# Altium schematic sheet Main_scheme.SchDoc
size 420 x 297 mm; Author: ALTIUM GOSTBOM2.0 KEV; SheetNumber: 1; SheetTotal: 1
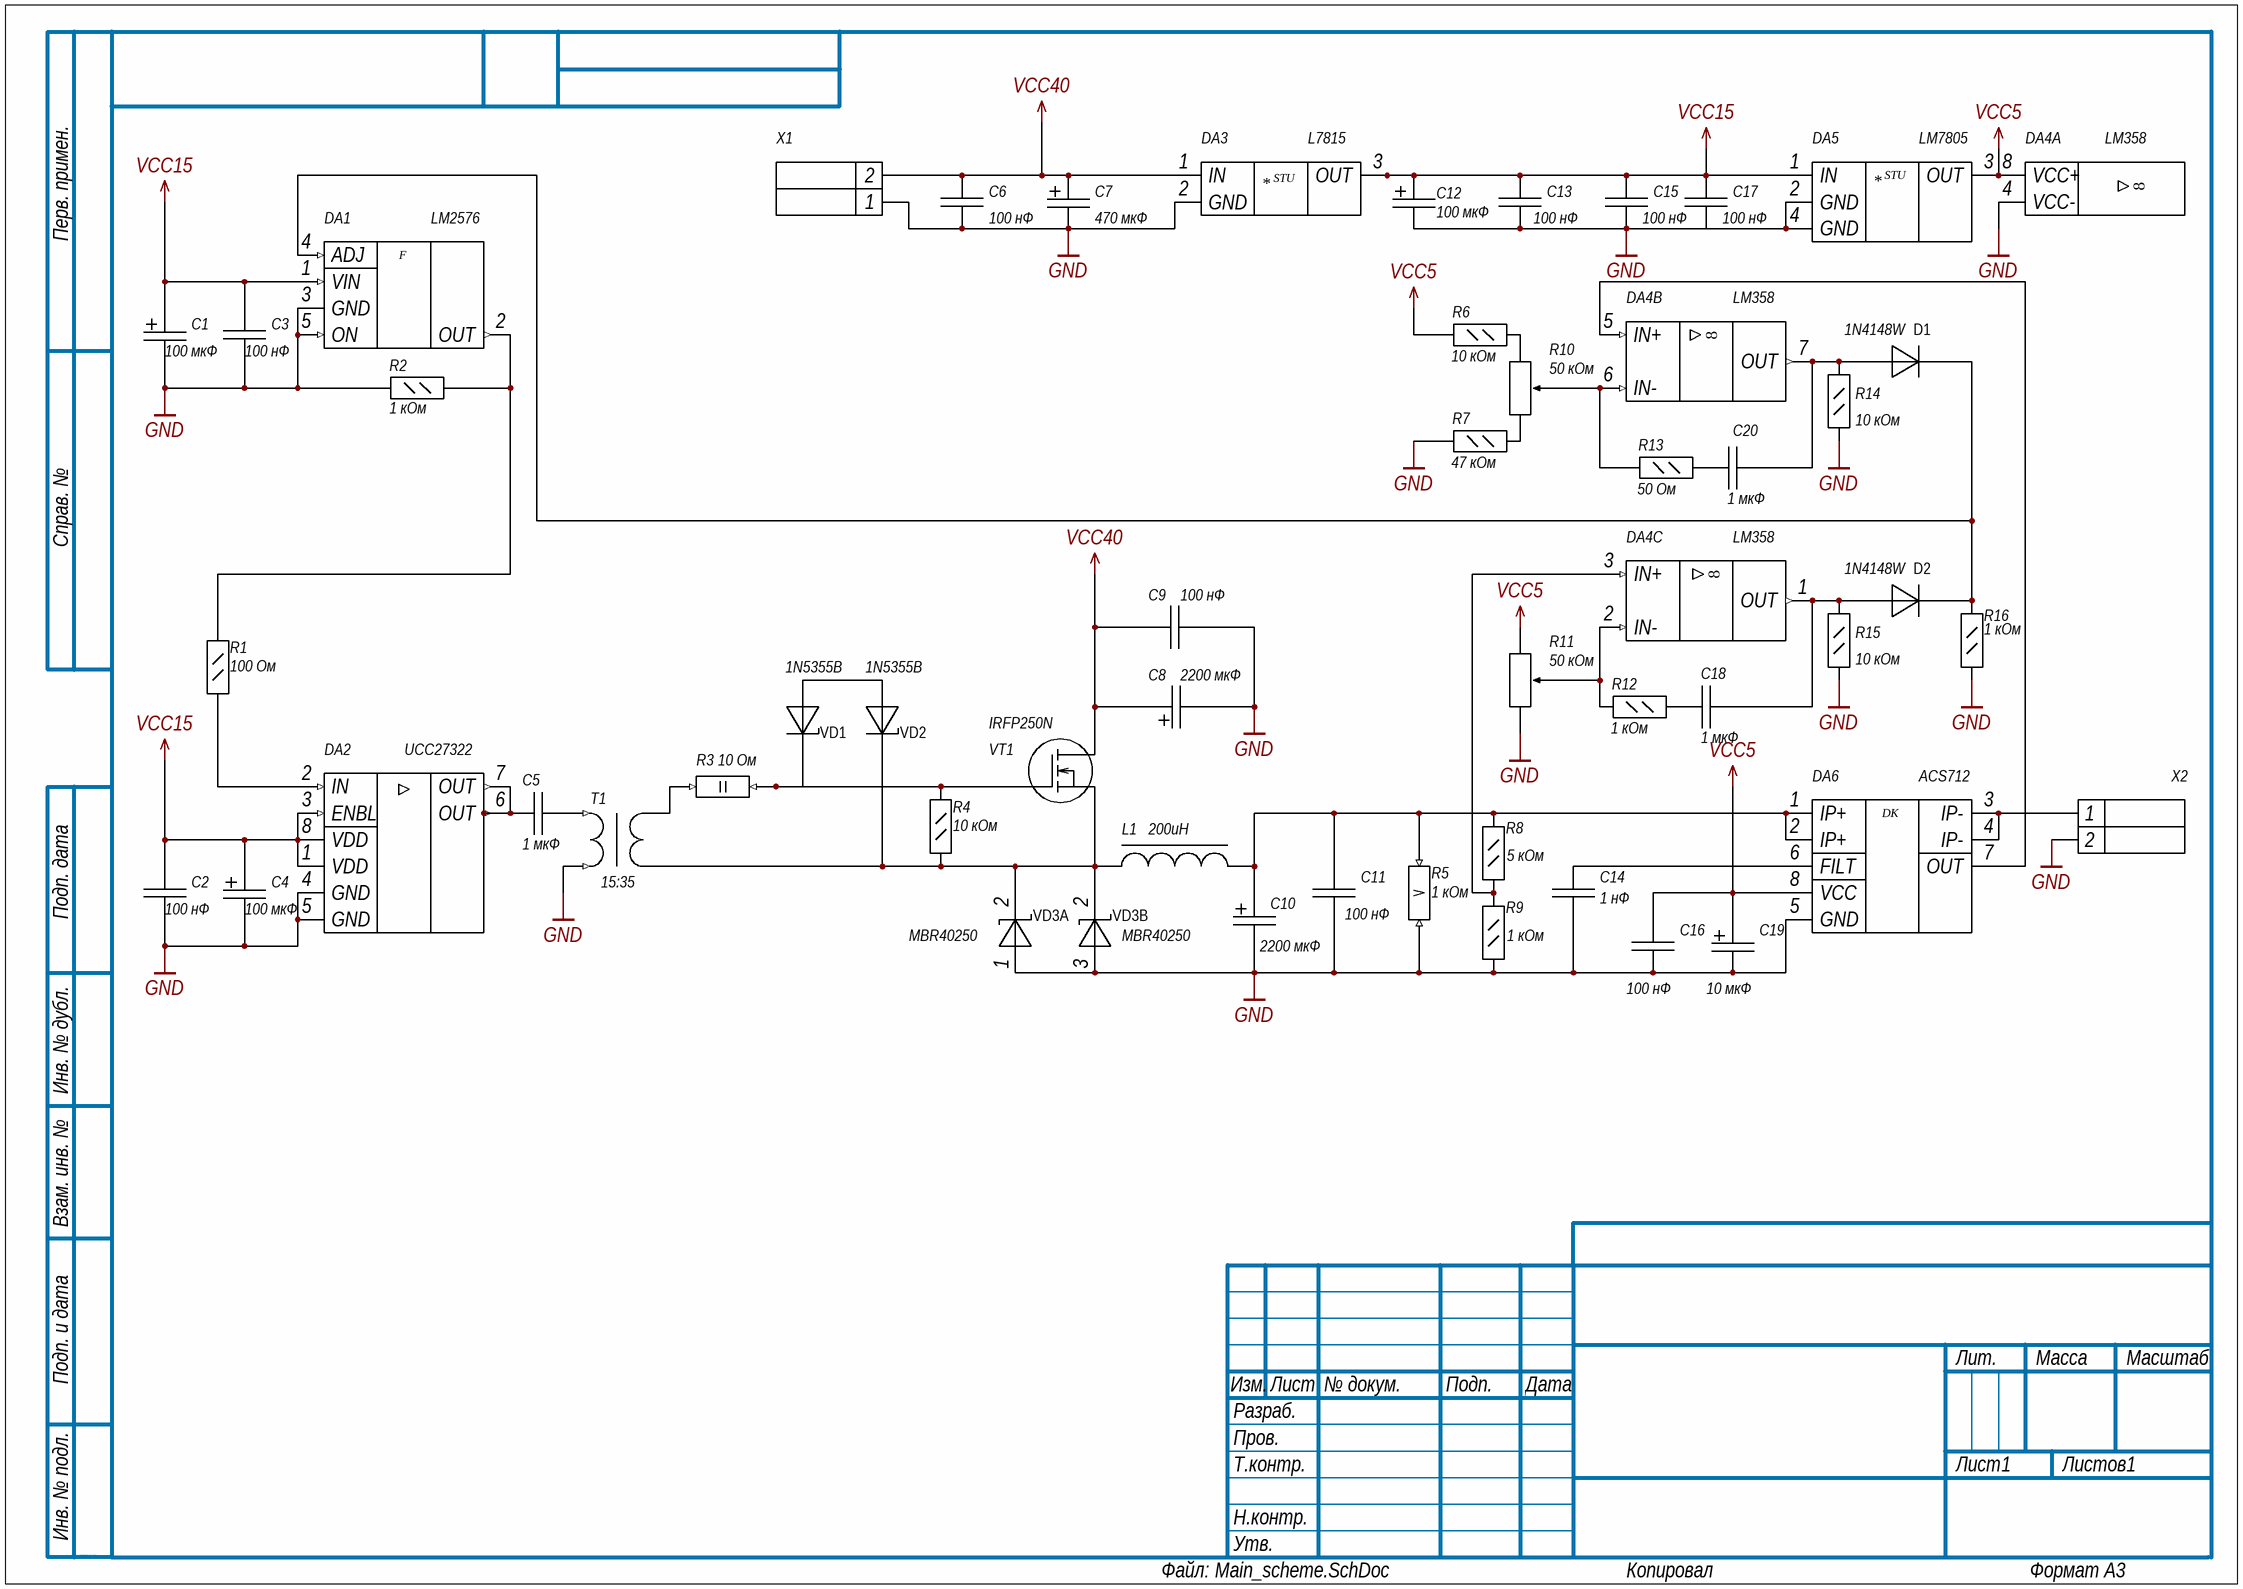
[diagram p0: Main_scheme.SchDoc]

## Parts
C1  100 мкФ  [CAP TH ALUM ELEC D8.00mm S3.50mm H12.50mm]
C2  100 нФ  [CAPC2012L-С0805]
C3  100 нФ  [CAPC2012L-С0805]
C4  100 мкФ  [CAP TH ALUM ELEC D8.00mm S3.50mm H12.50mm]
C5  1 мкФ  [CAP FILM 1210]
C6  100 нФ  [CAPC2012L-С0805]
C7  470 мкФ  [CAP TH ALUM ELEC D10.00mm S5.00mm H10.50mm]
C8  2200 мкФ  [CAP TH ALUM ELEC D18.00mm S7.50mm H42.00mm]
C9  100 нФ  [CAPC2012L-С0805]
C10  2200 мкФ  [CAP TH ALUM ELEC D18.00mm S7.50mm H42.00mm]
C11  100 нФ  [CAPC2012L-С0805]
C12  100 мкФ  [CAP TH ALUM ELEC D8.00mm S3.50mm H12.50mm]
C13  100 нФ  [CAPC2012L-С0805]
C14  1 нФ  [CAPC2012L-С0805]
C15  100 нФ  [CAPC2012L-С0805]
C16  100 нФ  [CAPC2012L-С0805]
C17  100 нФ  [CAPC2012L-С0805]
C18  1 мкФ  [CAPC2012L-С0805]
C19  10 мкФ  [CAP TH ALUM ELEC D5.00mm S2.00mm H11.00mm]
C20  1 мкФ  [CAPC2012L-С0805]
D1  1N4148W  [1N4148WVGS08]
D2  1N4148W  [1N4148WVGS08]
DA1  LM2576  [LM2576]
DA2  UCC27322  [SOIC127P599X175-8N]
DA3  L7815  [TO255P460X1020X2030-3P]
DA4  LM358  [SOIC127P600X175-8N]  (parts A,B,C of 3)
DA5  LM7805  [SOT230P700X180-4N]
DA6  ACS712  [SOIC127P600X175-8N]
L1  200uH  [IND_HCTI-220-5.8]
R1  100 Ом  [RESC2012N]
R2  1 кОм  [RESC2012N]
R3  10 Ом  [FP-MCS3264-IPC_A]
R4  10 кОм  [RESC2012N]
R5  1 кОм  [RESAD2860W80L2200D950]
R6  10 кОм  [RESC2012N]
R7  47 кОм  [RESC2012N]
R8  5 кОм  [RESC2012N]
R9  1 кОм  [RESC2012N]
R10  50 кОм  [PDB181K220K104B]
R11  50 кОм  [PDB181K220K104B]
R12  1 кОм  [RESC2012N]
R13  50 Ом  [RESC2012N]
R14  10 кОм  [RESC2012N]
R15  10 кОм  [RESC2012N]
R16  1 кОм  [RESC2012N]
T1  15:35  [WE-GDT_EP5]
VD1  1N5355B  [DIOAD2260W109L864D349]
VD2  1N5355B  [DIOAD2260W109L864D349]
VD3  MBR40250  [TO254P483X1010X2035-3P]  (parts A,B of 2)
VT1  IRFP250N  [TO545P530X1560X2460-3P]
X1  (no value)  [KLEMNIK2]
X2  (no value)  [KLEMNIK2]

## Nets
GND: C1.2 C2.1 C3.1 C4.2 C6.1 C7.2 C8.2 C9.1 C10.2 C11.1 C12.2 C13.1 C14.1 C15.1 C16.1 C17.1 C19.2 DA1.3(GND) DA1.5(ON) DA2.4(GND) DA2.5(GND) DA3.2(GND) DA4.4(VCC-) DA5.2(GND) DA5.4(GND) DA6.5(GND) R2.1 R5.1 R7.1 R9.2 R11.1(CCW) R14.2 R15.2 R16.2 T1.6 VD3.1(A_1) VD3.3(A_2) X1.1 X2.2
VCC5: C16.2 C19.1 DA4.8(VCC+) DA5.3(OUT) DA6.8(VCC) R6.1 R11.3(CW)
VCC15: C1.1 C2.2 C3.2 C4.1 C12.1 C13.2 C15.2 C17.2 DA1.1(VIN) DA2.1(VDD) DA2.3(ENBL) DA2.8(VDD) DA3.3(OUT) DA5.1(IN)
VCC40: C6.2 C7.1 C8.1 C9.2 DA3.1(IN) VT1.2(D) X1.2
NetC5_1: C5.1 T1.4
NetC5_2: C5.2 DA2.6(OUT) DA2.7(OUT)
NetC10_1: C10.1 C11.2 DA6.1(IP+) DA6.2(IP+) L1.2 R5.2 R8.1
NetC14_2: C14.2 DA6.6(FILT)
NetC18_1: C18.1 D2.2(A) DA4.1(OUT) R15.1
NetC18_2: C18.2 R12.2
NetC20_1: C20.1 D1.2(A) DA4.7(OUT) R14.1
NetC20_2: C20.2 R13.2
NetD1_1: D1.1(K) D2.1(K) DA1.4(ADJ) R16.1
NetDA1_2: DA1.2(OUT) R1.2 R2.2
NetDA2_2: DA2.2(IN) R1.1
NetDA4_2: DA4.2(IN-) R11.2(WIPER) R12.1
NetDA4_3: DA4.3(IN+) R8.2 R9.1
NetDA4_5: DA4.5(IN+) DA6.7(OUT)
NetDA4_6: DA4.6(IN-) R10.2(WIPER) R13.1
NetDA6_3: DA6.3(IP-) DA6.4(IP-) X2.1
NetL1_1: L1.1 R4.1 T1.3 VD2.2(A) VD3.2(K) VT1.3(S)
NetR3_1: R3.1 T1.1
NetR3_2: R3.2 R4.2 VD1.2(A) VT1.1(G)
NetR6_2: R6.2 R10.3(CW)
NetR7_2: R7.2 R10.1(CCW)
NetVD1_1: VD1.1(K) VD2.1(K)

## Notes on the sheet
- Перв. примен.
- Справ. №
- Подп. дата
- Инв. № дубл.
- Взам. инв. №
- Подп. и дата
- Изм.
- Разраб.
- Лист
- № докум.
- Подп.
- Дата
- Лит.
- Масса
- Масштаб
- Пров.
- Т.контр.
- Листов
- Инв. № подл.
- Н.контр.
- Утв.
- ALTIUM GOSTBOM2.0 KEV
- Файл:
- Копировал
- Формат А3
- (in symbol ACS712ELCTR-05B-T) DK
- (in symbol L7815CP) STU
- (in symbol LM2576-ADJ) F
- (in symbol LM7805MPX_NOPB) STU

## Library data of the parts
C1 C4 C12 = Polarised Capacitor_2: CAP ALUM 100UF 20% 25V RADIAL; Part Number: UKL1E101KPDANATD; manufacturer: Nichicon; Capacitance: 100µF; Lifetime @ Temp.: 1000 Hrs @ 105°C; Polarization: Polar; Ripple Current @ High Frequency: 420mA @ 10kHz; Ripple Current @ Low Frequency: 280mA @ 120Hz; Tolerance: ±10%; value: 100µF; Applications: General Purpose; componentlink1description: Datasheet; componentlink1url: http://nichicon-us.com/english/products/pdfs/e-ukl.pdf; componentlink2description: DigiKey Link; componentlink2url: http://digikey.com/product-detail/en/nichicon/UKL1E101KPDANATD/493-15360-1-ND/6555998; Device Package: Radial, Can; Height - Seated (Max): 0.492" (12.50mm); lastupdated: 07.09.2020 5:24:52; Lead Spacing: 0.138" (3.50mm); Lifecycle Status: Active; Minimum Order: 1; Mounting Type: Through Hole; Operating Temperature: -40°C ~ 105°C; Package / Case: Radial, Can; packaging: TapeAndBox; partid: 7205; Part Status: Active; price: 0.16; series: UKL; Size / Dimension: 0.315" Dia (8.00mm); Supplier 1: DigiKey; Supplier Part Number 1: 493-15360-1-ND; Voltage - Rated: 25V
C2 C3 C6 C9 C11 C13-C18 C20 = C0805: планарный конденсатор; Value: 0,1 мкФ
C5 = Capacitor_1: CAP FILM 1UF 20% 35VDC 1210; Part Number: 35MU105MB13225; Manufacturer: Rubycon; Dielectric Material: Acrylic, Metallized; Value: 1 µF; Voltage Rating - DC: 35V; Capacitance: 1 мкФ; Applications: DC Link, DC Filtering; ComponentLink1Description: Datasheet; ComponentLink1URL: http://www.rubycon.co.jp/en/catalog/e_pdfs/pmlcap/e_MU.pdf; ComponentLink2Description: DigiKey Link; ComponentLink2URL: https://www.digikey.com/en/products/detail/rubycon/35MU105MB13225/4969535; Device Package: 1210 (3225 Metric); Height - Seated (Max): 0.063" (1.60mm); LastUpdated: 01.11.2023 20:43:30; Lifecycle Status: Active; Minimum Order: 1; Mounting Type: Surface Mount; Operating Temperature: -55°C ~ 125°C; Package / Case: 1210 (3225 Metric); Packaging: TapeAndReel; Part Status: Active; Price: 2.41; Series: PMLCAP®, MU; Size / Dimension: 0.126" L x 0.098" W (3.20mm x 2.50mm); Supplier 1: DigiKey; Supplier Part Number 1: 1189-2529-1-ND; Termination: Solder Pads; Tolerance: ±20%
C7 = Polarised Capacitor_3: CAP ALUM 470UF 20% 25V RADIAL; Part Number: 25WA470MEFCT810X9; manufacturer: Rubycon; Capacitance: 470µF; Lifetime @ Temp.: 2000 Hrs @ 85°C; Polarization: Polar; Ripple Current @ Low Frequency: 460mA @ 120Hz; value: 470µF; Applications: General Purpose; componentlink1description: Datasheet; componentlink1url: http://www.rubycon.co.jp/en/catalog/e_pdfs/aluminum/e_wa.pdf; componentlink2description: DigiKey Link; componentlink2url: http://digikey.com/product-detail/en/rubycon/25WA470MEFCT810X9/1189-3717-1-ND/6599186; Device Package: Radial, Can; Height - Seated (Max): 0.413" (10.50mm); lastupdated: 02.09.2020 1:26:22; Lead Spacing: 0.197" (5.00mm); Lifecycle Status: Active; Minimum Order: 1; Mounting Type: Through Hole; Operating Temperature: -40°C ~ 85°C; Package / Case: Radial, Can; packaging: TapeAndBox; partid: 9499; Part Status: Active; price: 0.17; series: WA; Size / Dimension: 0.394" Dia (10.00mm); Supplier 1: DigiKey; Supplier Part Number 1: 1189-3717-1-ND; Tolerance: ±20%; Voltage - Rated: 25V
C8 C10 = Polarised Capacitor: CAP ALUM 2200UF 20% 50V RADIAL; Part Number: 50RX302200M18X40; manufacturer: Rubycon; Capacitance: 2200µF; Impedance: 29 mOhms; Lifetime @ Temp.: 4000 Hrs @ 130°C; Polarization: Polar; Ripple Current @ High Frequency: 2.8A @ 100kHz; Ripple Current @ Low Frequency: 2.24A @ 120Hz; value: 2200µF; Applications: Automotive; componentlink1description: Datasheet; componentlink1url: http://www.rubycon.co.jp/en/catalog/e_pdfs/aluminum/e_rx30.pdf; componentlink2description: DigiKey Link; componentlink2url: http://digikey.com/product-detail/en/rubycon/50RX302200M18X40/1189-1410-ND/3134366; Device Package: Radial, Can; Height - Seated (Max): 1.654" (42.00mm); lastupdated: 02.09.2020 1:33:35; Lead Spacing: 0.295" (7.50mm); Lifecycle Status: Active; Minimum Order: 1; Mounting Type: Through Hole; Operating Temperature: -40°C ~ 130°C; Package / Case: Radial, Can; packaging: Bulk; partid: 9389; Part Status: Active; price: 3.85; Ratings: AEC-Q200; series: RX30; Size / Dimension: 0.709" Dia (18.00mm); Supplier 1: DigiKey; Supplier Part Number 1: 1189-1410-ND; Tolerance: ±20%; Voltage - Rated: 50V
C19 = Polarised Capacitor_1: CAP ALUM 10UF 20% 16V RADIAL; Part Number: UPW1C100MDD; manufacturer: Nichicon; Capacitance: 10µF; Impedance: 600 mOhms; Lifetime @ Temp.: 2000 Hrs @ 105°C; Polarization: Polar; Ripple Current @ High Frequency: 180mA @ 100kHz; Ripple Current @ Low Frequency: 54mA @ 120Hz; value: 10µF; Applications: General Purpose; componentlink1description: Datasheet; componentlink1url: http://nichicon-us.com/english/products/pdfs/e-upw.pdf; componentlink2description: DigiKey Link; componentlink2url: http://digikey.com/product-detail/en/nichicon/UPW1C100MDD/493-1767-ND/589508; Device Package: Radial, Can; Height - Seated (Max): 0.433" (11.00mm); lastupdated: 04.09.2020 23:28:56; Lead Spacing: 0.079" (2.00mm); Lifecycle Status: Active; Minimum Order: 1; Mounting Type: Through Hole; Operating Temperature: -55°C ~ 105°C; Package / Case: Radial, Can; packaging: Bulk; partid: 21402; Part Status: Active; price: 0.26; series: UPW; Size / Dimension: 0.197" Dia (5.00mm); Supplier 1: DigiKey; Supplier Part Number 1: 493-1767-ND; Tolerance: ±20%; Voltage - Rated: 16V
D1 D2 = 1N4148W-V-GS08: Diode; Manufacturer_Name: Vishay; Datasheet Link: https://us.rs-online.com/m/d/a2789c8794cb0c42ced29f2dd8571f3c.pdf; Height: 1.35mm; Manufacturer_Part_Number: 1N4148W-V-GS08; Mouser Part Number: 625-1N4148W-V; Mouser Price/Stock: https://www.mouser.co.uk/ProductDetail/Vishay-Semiconductors/1N4148W-V-GS08?qs=TNTIDjy6APrS%2Fdgq1RSs3A%3D%3D; Arrow Part Number: 1N4148W-V-GS08; Arrow Price/Stock: https://www.arrow.com/en/products/1n4148w-v-gs08/vishay
DA1 = LM2576-ADJ: Buck-boost converter
DA2 = UCC27322: Single 9-A High-Speed Low-Side Mosfet Driver With Enable
DA3 = L7815CP: 15 V Linear stab; Manufacturer_Name: STMicroelectronics; Datasheet Link: http://www.st.com/web/en/resource/technical/document/datasheet/CD00000444.pdf; Height: 4.6mm; Manufacturer_Part_Number: L7815CP; Mouser Part Number: 511-L7815CP; Mouser Price/Stock: https://www.mouser.co.uk/ProductDetail/STMicroelectronics/L7815CP?qs=%252BX2uje6VeKVI9cfwuCNq4A%3D%3D; Arrow Part Number: L7815CP; Arrow Price/Stock: https://www.arrow.com/en/products/l7815cp/stmicroelectronics?region=europe
DA4 = LM358: OP AMP
DA5 = LM7805MPX_NOPB: 5 V Linear stab; Manufacturer_Name: Texas Instruments; Manufacturer_Part_Number: LM7805MPX/NOPB; Datasheet Link: https://www.arrow.com/en/products/lm7805mpxnopb/texas-instruments; Height: 1.8mm; Mouser Part Number: 595-LM7805MPX/NOPB; Mouser Price/Stock: https://www.mouser.co.uk/ProductDetail/Texas-Instruments/LM7805MPX-NOPB?qs=gO6GG99qvRCSwIVAoVKHPw%3D%3D; Arrow Part Number: LM7805MPX/NOPB; Arrow Price/Stock: https://www.arrow.com/en/products/lm7805mpxnopb/texas-instruments?region=nac
DA6 = ACS712ELCTR-05B-T: ampermeter ic; Manufacturer_Name: Sharp Microelectronics; Datasheet Link: https://www.allegromicro.com/~/media/Files/Datasheets/ACS712-Datasheet.ashx; Height: 1.75mm; Manufacturer_Part_Number: ACS712ELCTR-05B-T
L1 = Inductor
R1 R2 R4 R6-R9 R12-R16 = R0805: планарный резистор; Value: 1кОм
R3 = Resistor 2W: 2W
R5 = Resistor 5W: 5W
R10 R11 = PDB181-K420K-105A2: Variable Resistor; Manufacturer_Name: Bourns; Datasheet Link: https://www.bourns.com/docs/product-datasheets/PDB18.pdf; Height: 16.5mm; Manufacturer_Part_Number: PDB181-K420K-105A2; Mouser Part Number: 652-PDB181K420K105A2; Mouser Price/Stock: https://www.mouser.co.uk/ProductDetail/Bourns/PDB181-K420K-105A2?qs=HVbQlW5zcXUfmN1nKSXlOQ%3D%3D; Arrow Part Number: PDB181-K420K-105A2; Arrow Price/Stock: https://www.arrow.com/en/products/pdb181-k420k-105a2/bourns?region=nac
T1 = Transformer
VD1 VD2 = 1N5355B: Zener Diode; Manufacturer_Name: Galaxy; Datasheet Link: https://www.onsemi.com/pdf/datasheet/1n5333b-d.pdf; Manufacturer_Part_Number: 1N5355B
VD3 = MBR40250TG: Shootky Diode; Manufacturer_Name: onsemi; Datasheet Link: http://www.onsemi.com/pub/Collateral/MBR40250-D.PDF; Height: 4.83mm; Manufacturer_Part_Number: MBR40250TG; Mouser Part Number: 863-MBR40250TG; Mouser Price/Stock: https://www.mouser.co.uk/ProductDetail/onsemi/MBR40250TG?qs=3JMERSakebr9LpXNBMS%2FzA%3D%3D; Arrow Part Number: MBR40250TG; Arrow Price/Stock: https://www.arrow.com/en/products/mbr40250tg/on-semiconductor?region=nac
VT1 = IRFP250N: MOSFET (N-Channel); Manufacturer_Name: Infineon; Datasheet Link: https://www.infineon.com/dgdl/Infineon-IRFP250N-DataSheet-v01_01-EN.pdf?fileId=5546d462533600a4015356288b8b1fde; Height: 5.3mm; Manufacturer_Part_Number: IRFP250N; Mouser Part Number: N/A; Mouser Price/Stock: https://www.mouser.co.uk/ProductDetail/Infineon-IR/IRFP250N?qs=Gkr2N%2F2q3o3iFaFA442Z6g%3D%3D
X1 X2 = KLEMMNIK2